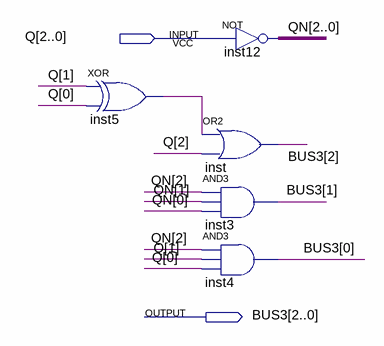
[diagram p0: schematic sheet]
// Quartus schematic BUS3.bdf as structural Verilog: 5 symbols, 2 pins
module BUS3 (
  input  [2:0] Q,
  output [2:0] BUS3
);

  wire inst5_out;
  wire [2:0] QN;

  xor inst5 (inst5_out, Q[1], Q[0]);
  assign QN = ~Q;  // NOT inst12, 3 bits wide
  or inst (BUS3[2], inst5_out, Q[2]);
  and inst3 (BUS3[1], QN[2], QN[1], QN[0]);
  and inst4 (BUS3[0], QN[2], Q[1], Q[0]);
endmodule
